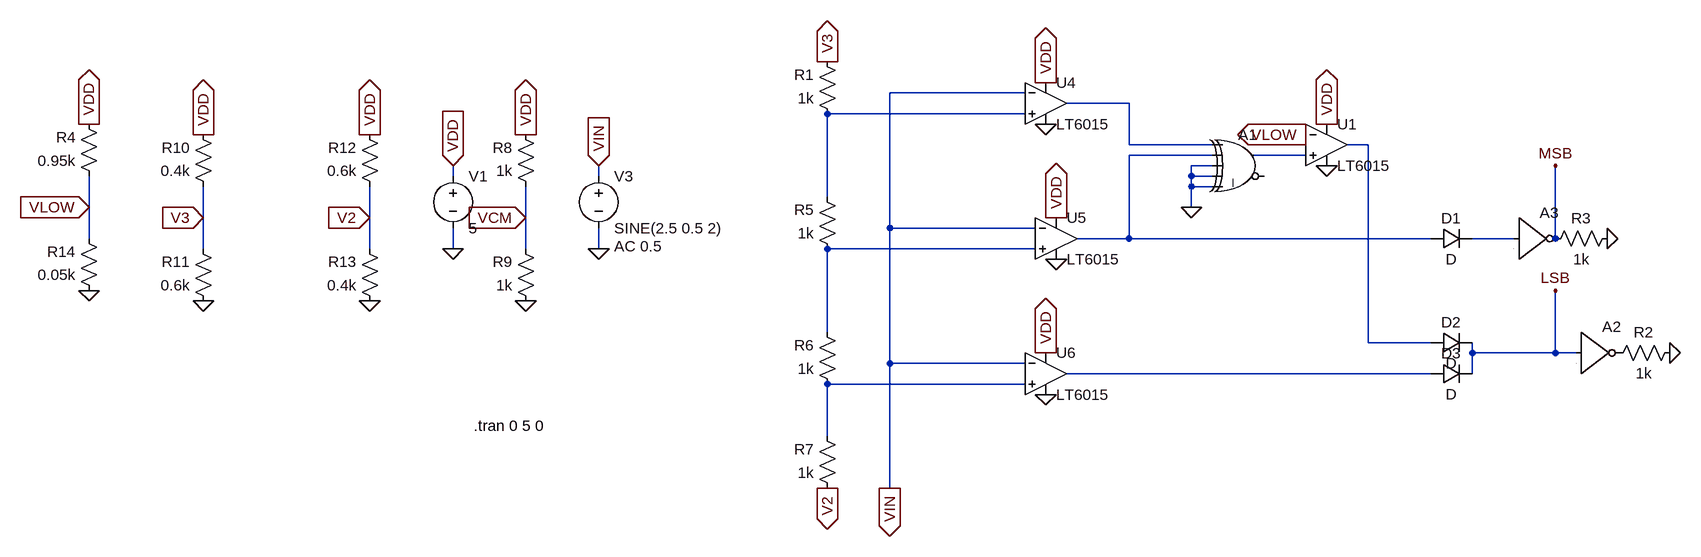
[diagram p0: schematic 2bitadc.asc]
2bitadc.asc, the LTspice schematic file:
Version 4.1
SHEET 1 2920 680
WIRE 688 -32 480 -32
WIRE 848 -16 752 -16
WIRE 688 0 384 0
WIRE 848 48 848 -16
WIRE 976 48 848 48
WIRE 1216 48 1184 48
WIRE 976 64 848 64
WIRE 1120 64 1040 64
WIRE 976 80 944 80
WIRE -192 96 -192 80
WIRE 32 96 32 80
WIRE 944 96 944 80
WIRE 976 96 944 96
WIRE 944 112 944 96
WIRE 976 112 944 112
WIRE 384 128 384 0
WIRE -752 144 -752 96
WIRE 944 144 944 112
WIRE -576 160 -576 112
WIRE -320 160 -320 112
WIRE -80 160 -80 112
WIRE 480 176 480 -32
WIRE 704 176 480 176
WIRE -752 192 -752 144
WIRE 848 192 848 64
WIRE 848 192 768 192
WIRE 1312 192 848 192
WIRE 1440 192 1376 192
WIRE 1504 192 1504 80
WIRE -576 208 -576 160
WIRE -320 208 -320 160
WIRE -192 208 -192 176
WIRE -80 208 -80 160
WIRE 32 208 32 176
WIRE 704 208 384 208
WIRE 384 336 384 208
WIRE 1216 352 1216 48
WIRE 1312 352 1216 352
WIRE 1376 368 1376 352
WIRE 1504 368 1504 272
WIRE 1504 368 1376 368
WIRE 1536 368 1504 368
WIRE 480 384 480 176
WIRE 688 384 480 384
WIRE 1312 400 752 400
WIRE 1376 400 1376 368
WIRE 688 416 384 416
WIRE 384 496 384 416
WIRE 480 576 480 384
FLAG -192 80 VDD
IOPIN -192 80 In
FLAG 32 80 VIN
IOPIN 32 80 In
FLAG -192 208 0
FLAG 32 208 0
FLAG 384 -80 V3
IOPIN 384 -80 Out
FLAG 384 576 V2
IOPIN 384 576 Out
FLAG -80 32 VDD
IOPIN -80 32 Out
FLAG -80 288 0
FLAG -80 160 VCM
IOPIN -80 160 In
FLAG -576 32 VDD
IOPIN -576 32 Out
FLAG -576 288 0
FLAG -576 160 V3
IOPIN -576 160 In
FLAG -320 32 VDD
IOPIN -320 32 Out
FLAG -320 288 0
FLAG -320 160 V2
IOPIN -320 160 In
FLAG 720 -48 VDD
IOPIN 720 -48 Out
FLAG 736 160 VDD
IOPIN 736 160 Out
FLAG 720 368 VDD
IOPIN 720 368 Out
FLAG 720 16 0
FLAG 736 224 0
FLAG 720 432 0
FLAG 480 576 VIN
IOPIN 480 576 Out
FLAG 944 144 0
FLAG 1680 368 0
FLAG 1584 192 0
FLAG 1152 16 VDD
IOPIN 1152 16 Out
FLAG 1152 80 0
FLAG -752 16 VDD
IOPIN -752 16 Out
FLAG -752 272 0
FLAG -752 144 VLOW
IOPIN -752 144 In
FLAG 1120 32 VLOW
IOPIN 1120 32 Out
FLAG 1504 80 MSB
FLAG 1504 272 LSB
SYMBOL voltage -192 80 R0
WINDOW 123 0 0 Left 0
WINDOW 39 0 0 Left 0
SYMATTR InstName V1
SYMATTR Value 5
SYMBOL voltage 32 80 R0
WINDOW 123 24 124 Left 2
WINDOW 39 0 0 Left 0
SYMATTR Value2 AC 0.5
SYMATTR InstName V3
SYMATTR Value SINE(2.5 0.5 2)
SYMBOL res 400 16 R180
WINDOW 0 36 76 Left 2
WINDOW 3 36 40 Left 2
SYMATTR InstName R1
SYMATTR Value 1k
SYMBOL res 400 224 R180
WINDOW 0 36 76 Left 2
WINDOW 3 36 40 Left 2
SYMATTR InstName R5
SYMATTR Value 1k
SYMBOL res 400 432 R180
WINDOW 0 36 76 Left 2
WINDOW 3 36 40 Left 2
SYMATTR InstName R6
SYMATTR Value 1k
SYMBOL res 400 592 R180
WINDOW 0 36 76 Left 2
WINDOW 3 36 40 Left 2
SYMATTR InstName R7
SYMATTR Value 1k
SYMBOL res -64 128 R180
WINDOW 0 36 76 Left 2
WINDOW 3 36 40 Left 2
SYMATTR InstName R8
SYMATTR Value 1k
SYMBOL res -64 304 R180
WINDOW 0 36 76 Left 2
WINDOW 3 36 40 Left 2
SYMATTR InstName R9
SYMATTR Value 1k
SYMBOL res -560 128 R180
WINDOW 0 36 76 Left 2
WINDOW 3 36 40 Left 2
SYMATTR InstName R10
SYMATTR Value 0.4k
SYMBOL res -560 304 R180
WINDOW 0 36 76 Left 2
WINDOW 3 36 40 Left 2
SYMATTR InstName R11
SYMATTR Value 0.6k
SYMBOL res -304 128 R180
WINDOW 0 36 76 Left 2
WINDOW 3 36 40 Left 2
SYMATTR InstName R12
SYMATTR Value 0.6k
SYMBOL res -304 304 R180
WINDOW 0 36 76 Left 2
WINDOW 3 36 40 Left 2
SYMATTR InstName R13
SYMATTR Value 0.4k
SYMBOL OpAmps\\LT6015 720 -16 R0
SYMATTR InstName U4
SYMBOL OpAmps\\LT6015 736 192 R0
SYMATTR InstName U5
SYMBOL OpAmps\\LT6015 720 400 R0
SYMATTR InstName U6
SYMBOL Digital\\xor 1024 16 R0
SYMATTR InstName A1
SYMBOL diode 1312 208 R270
WINDOW 0 32 32 VTop 2
WINDOW 3 0 32 VBottom 2
SYMATTR InstName D1
SYMBOL diode 1312 368 R270
WINDOW 0 32 32 VTop 2
WINDOW 3 0 32 VBottom 2
SYMATTR InstName D2
SYMBOL diode 1312 416 R270
WINDOW 0 32 32 VTop 2
WINDOW 3 0 32 VBottom 2
SYMATTR InstName D3
SYMBOL res 1696 352 R90
WINDOW 0 0 56 VBottom 2
WINDOW 3 32 56 VTop 2
SYMATTR InstName R2
SYMATTR Value 1k
SYMBOL res 1600 176 R90
WINDOW 0 0 56 VBottom 2
WINDOW 3 32 56 VTop 2
SYMATTR InstName R3
SYMATTR Value 1k
SYMBOL OpAmps\\LT6015 1152 48 R0
SYMATTR InstName U1
SYMBOL res -736 112 R180
WINDOW 0 36 76 Left 2
WINDOW 3 36 40 Left 2
SYMATTR InstName R4
SYMATTR Value 0.95k
SYMBOL res -736 288 R180
WINDOW 0 36 76 Left 2
WINDOW 3 36 40 Left 2
SYMATTR InstName R14
SYMATTR Value 0.05k
SYMBOL Digital\\inv 1536 304 R0
SYMATTR InstName A2
SYMBOL Digital\\inv 1440 128 R0
SYMATTR InstName A3
TEXT -160 480 Left 2 !.tran 0 5 0

The netlist it stands for:
* 2bitadc.asc
V1 VDD 0 5
V3 VIN 0 SINE(2.5 0.5 2) AC 0.5
R1 N002 V3 1k
R5 N007 N002 1k
R6 N009 N007 1k
R7 V2 N009 1k
R8 VCM VDD 1k
R9 0 VCM 1k
R10 V3 VDD 0.4k
R11 0 V3 0.6k
R12 V2 VDD 0.6k
R13 0 V2 0.4k
X§U4 N002 VIN VDD 0 N001 LT6016  ; LT6015, pins In+ In- V+ V- OUT
X§U5 N007 VIN VDD 0 N004 LT6016  ; LT6015, pins In+ In- V+ V- OUT
X§U6 N009 VIN VDD 0 N008 LT6016  ; LT6015, pins In+ In- V+ V- OUT
A1 N001 N004 0 0 0 0 N005 0 XOR
D1 N004 N006 D
D2 N003 LSB D
D3 N008 LSB D
R2 0 P001 1k
R3 0 MSB 1k
X§U1 N005 VLOW VDD 0 N003 LT6016  ; LT6015, pins In+ In- V+ V- OUT
R4 VLOW VDD 0.95k
R14 0 VLOW 0.05k
A2 LSB 0 0 0 0 P001 0 0 BUF
A3 N006 0 0 0 0 MSB 0 0 BUF
.model D D
.lib standard.dio
.tran 0 5 0
.lib LTC2.lib
.backanno
.end